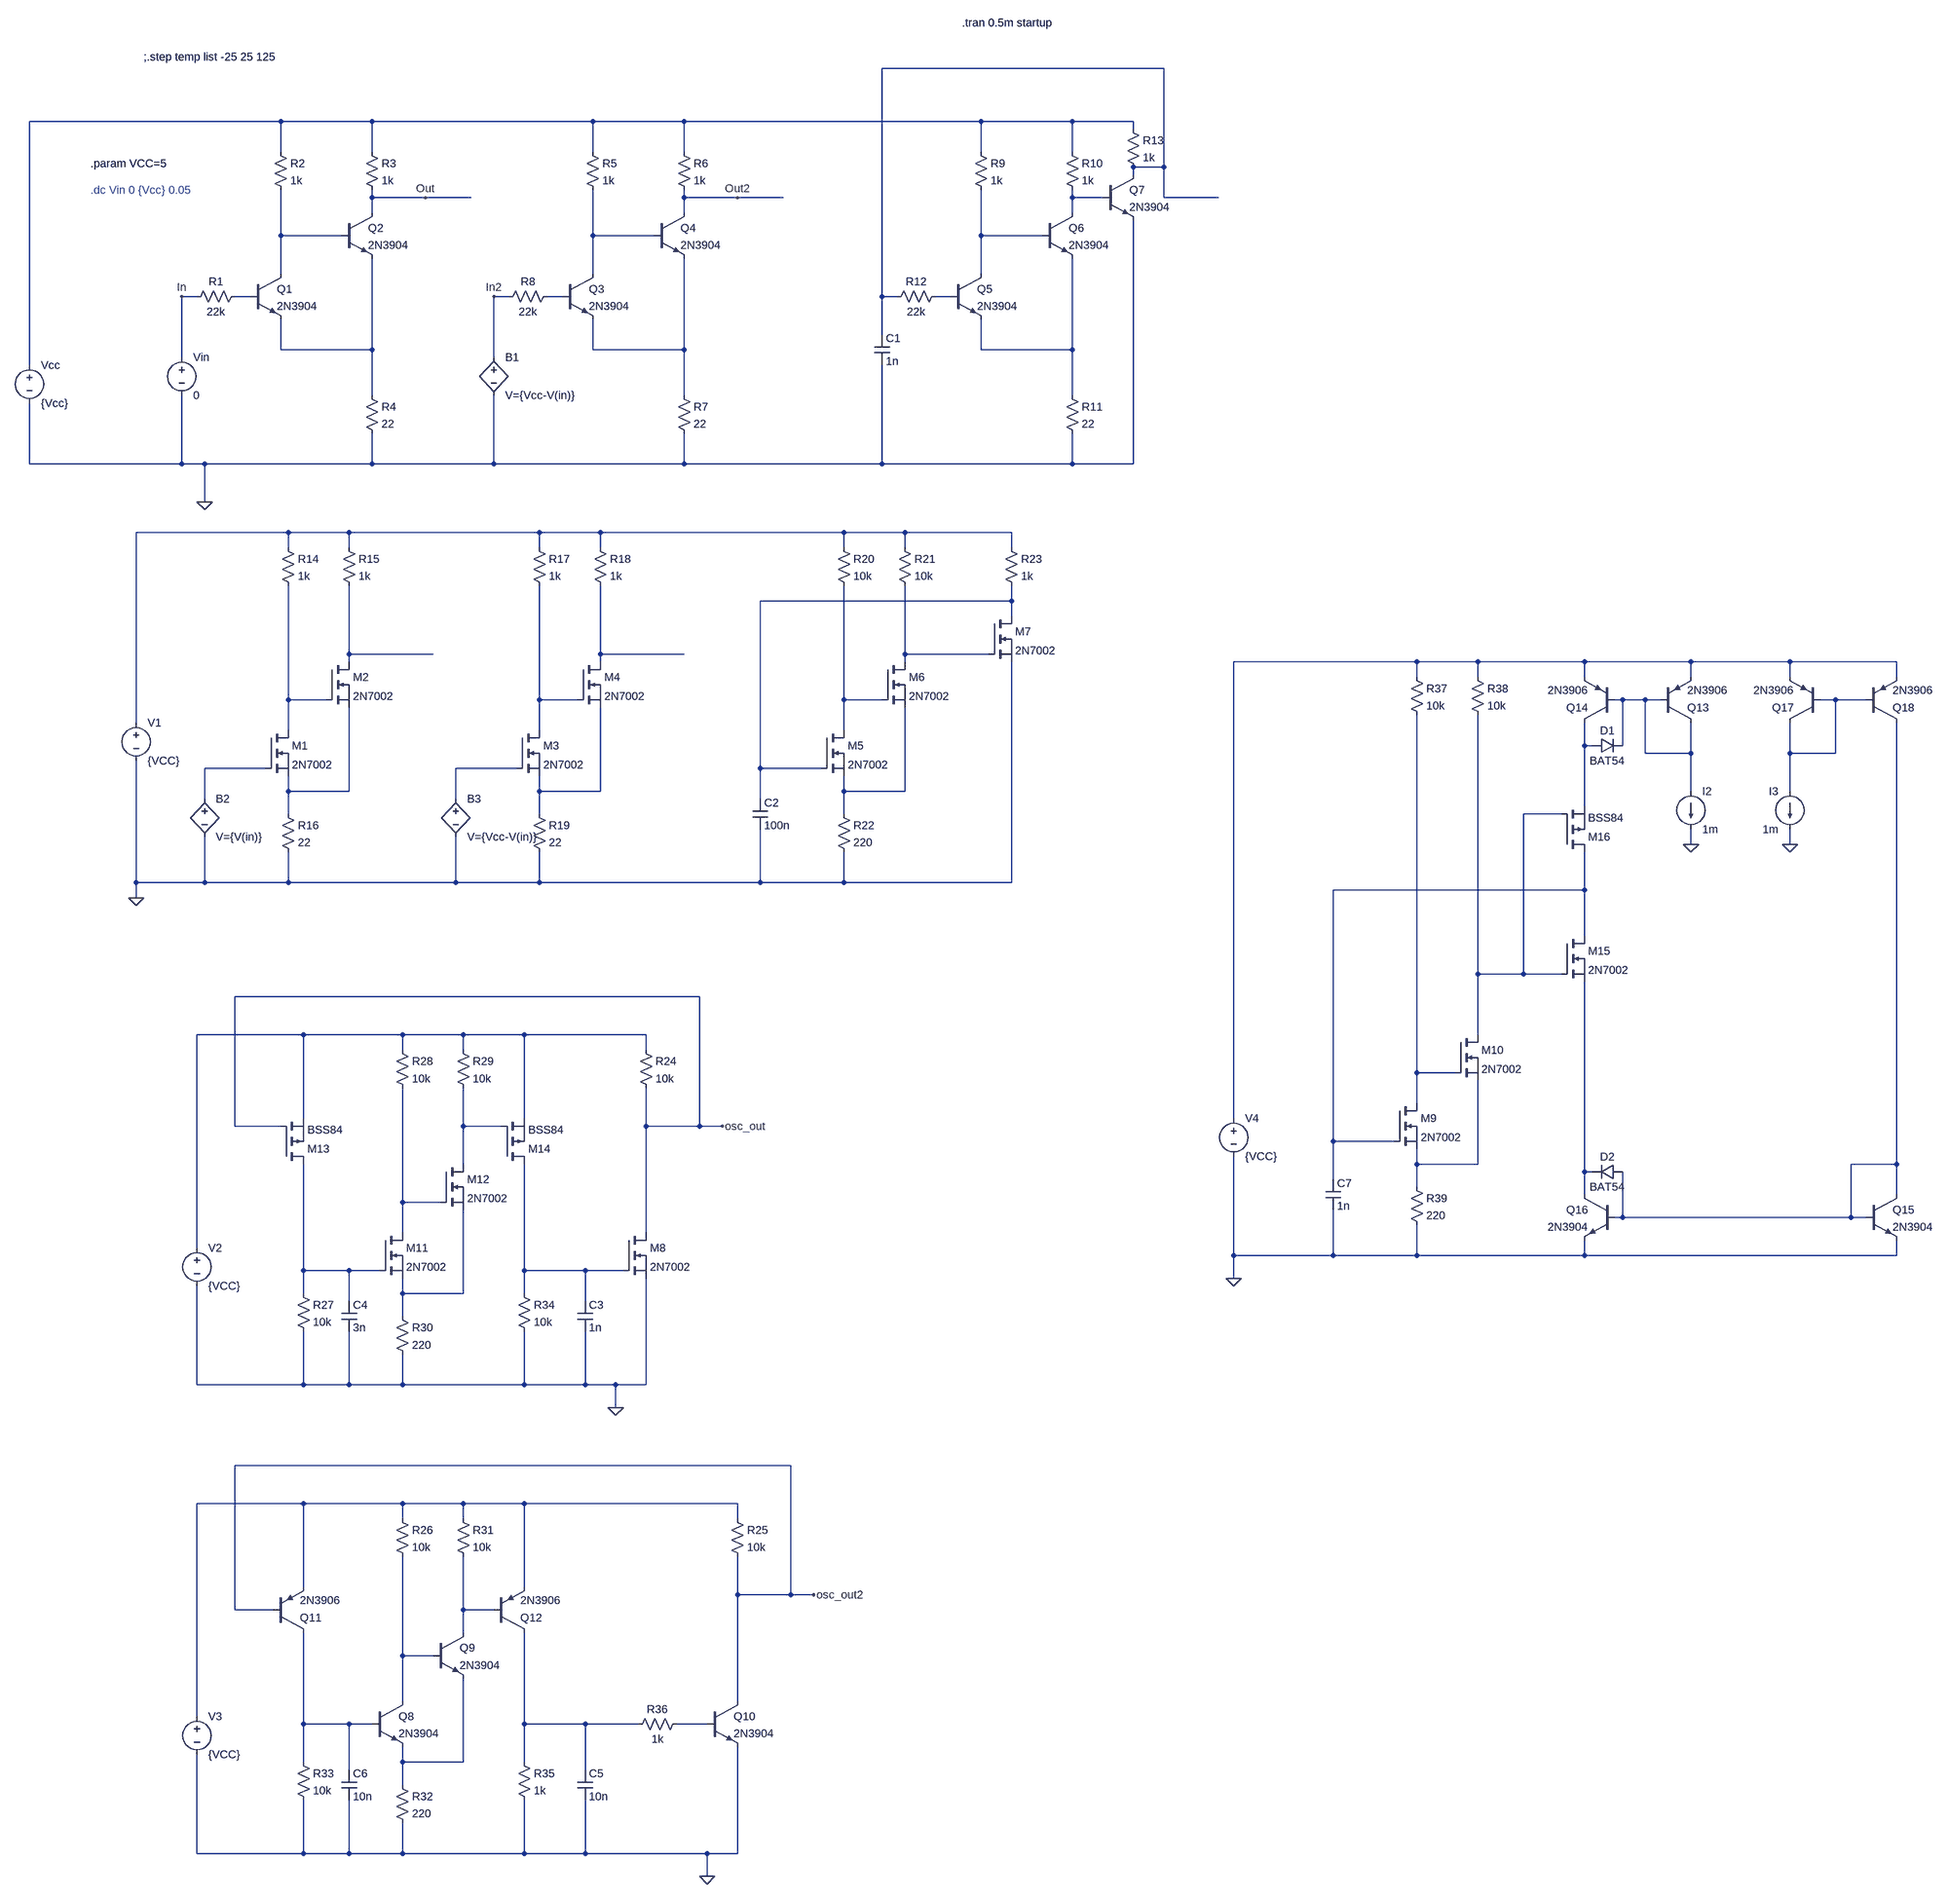
[diagram p0: schematic schmidt_trigger.asc]
schmidt_trigger.asc, the LTspice schematic file:
Version 4.1
SHEET 1 3940 3804
WIRE 2064 -352 1472 -352
WIRE 208 -240 -320 -240
WIRE 400 -240 208 -240
WIRE 864 -240 400 -240
WIRE 1056 -240 864 -240
WIRE 1680 -240 1056 -240
WIRE 1872 -240 1680 -240
WIRE 2000 -240 1872 -240
WIRE 2000 -224 2000 -240
WIRE 208 -176 208 -240
WIRE 400 -176 400 -240
WIRE 864 -176 864 -240
WIRE 1056 -176 1056 -240
WIRE 1680 -176 1680 -240
WIRE 1872 -176 1872 -240
WIRE 2064 -144 2064 -352
WIRE 2064 -144 2000 -144
WIRE 2000 -128 2000 -144
WIRE 400 -80 400 -96
WIRE 512 -80 400 -80
WIRE 608 -80 512 -80
WIRE 1056 -80 1056 -96
WIRE 1168 -80 1056 -80
WIRE 1264 -80 1168 -80
WIRE 1872 -80 1872 -96
WIRE 1936 -80 1872 -80
WIRE 2064 -80 2064 -144
WIRE 2304 -80 2064 -80
WIRE 400 -48 400 -80
WIRE 1056 -48 1056 -80
WIRE 1872 -48 1872 -80
WIRE 208 0 208 -96
WIRE 336 0 208 0
WIRE 864 0 864 -96
WIRE 992 0 864 0
WIRE 1680 0 1680 -96
WIRE 1808 0 1680 0
WIRE 208 80 208 0
WIRE 864 80 864 0
WIRE 1680 80 1680 0
WIRE 32 128 0 128
WIRE 144 128 112 128
WIRE 688 128 656 128
WIRE 800 128 768 128
WIRE 1472 128 1472 -352
WIRE 1504 128 1472 128
WIRE 1616 128 1584 128
WIRE 1472 208 1472 128
WIRE 208 240 208 176
WIRE 400 240 400 48
WIRE 400 240 208 240
WIRE 864 240 864 176
WIRE 1056 240 1056 48
WIRE 1056 240 864 240
WIRE 1680 240 1680 176
WIRE 1872 240 1872 48
WIRE 1872 240 1680 240
WIRE 0 256 0 128
WIRE 656 256 656 128
WIRE -320 272 -320 -240
WIRE 400 336 400 240
WIRE 1056 336 1056 240
WIRE 1872 336 1872 240
WIRE -320 480 -320 352
WIRE 0 480 0 336
WIRE 0 480 -320 480
WIRE 48 480 0 480
WIRE 400 480 400 416
WIRE 400 480 48 480
WIRE 656 480 656 336
WIRE 656 480 400 480
WIRE 1056 480 1056 416
WIRE 1056 480 656 480
WIRE 1472 480 1472 272
WIRE 1472 480 1056 480
WIRE 1872 480 1872 416
WIRE 1872 480 1472 480
WIRE 2000 480 2000 -32
WIRE 2000 480 1872 480
WIRE 48 560 48 480
WIRE 224 624 -96 624
WIRE 352 624 224 624
WIRE 752 624 352 624
WIRE 880 624 752 624
WIRE 1392 624 880 624
WIRE 1520 624 1392 624
WIRE 1744 624 1520 624
WIRE 224 656 224 624
WIRE 352 656 352 624
WIRE 752 656 752 624
WIRE 880 656 880 624
WIRE 1392 656 1392 624
WIRE 1520 656 1520 624
WIRE 1744 656 1744 624
WIRE 1744 768 1744 736
WIRE 1744 768 1216 768
WIRE 1744 800 1744 768
WIRE 352 880 352 736
WIRE 528 880 352 880
WIRE 880 880 880 736
WIRE 1056 880 880 880
WIRE 1520 880 1520 736
WIRE 1696 880 1520 880
WIRE 352 896 352 880
WIRE 880 896 880 880
WIRE 1520 896 1520 880
WIRE 2736 896 2336 896
WIRE 2864 896 2736 896
WIRE 3088 896 2864 896
WIRE 3312 896 3088 896
WIRE 3520 896 3312 896
WIRE 3744 896 3520 896
WIRE 2736 928 2736 896
WIRE 2864 928 2864 896
WIRE 3088 928 3088 896
WIRE 3312 928 3312 896
WIRE 3520 928 3520 896
WIRE 3744 928 3744 896
WIRE 224 976 224 736
WIRE 304 976 224 976
WIRE 752 976 752 736
WIRE 832 976 752 976
WIRE 1392 976 1392 736
WIRE 1472 976 1392 976
WIRE 3168 976 3152 976
WIRE 3216 976 3168 976
WIRE 3248 976 3216 976
WIRE 3616 976 3584 976
WIRE 3680 976 3616 976
WIRE -96 1024 -96 624
WIRE 224 1040 224 976
WIRE 752 1040 752 976
WIRE 1392 1040 1392 976
WIRE 3088 1072 3088 1024
WIRE 3104 1072 3088 1072
WIRE 3168 1072 3168 976
WIRE 3216 1088 3216 976
WIRE 3312 1088 3312 1024
WIRE 3312 1088 3216 1088
WIRE 3520 1088 3520 1024
WIRE 3616 1088 3616 976
WIRE 3616 1088 3520 1088
WIRE 176 1120 48 1120
WIRE 704 1120 576 1120
WIRE 1216 1120 1216 768
WIRE 1344 1120 1216 1120
WIRE 224 1168 224 1136
WIRE 352 1168 352 992
WIRE 352 1168 224 1168
WIRE 752 1168 752 1136
WIRE 880 1168 880 992
WIRE 880 1168 752 1168
WIRE 1392 1168 1392 1136
WIRE 1520 1168 1520 992
WIRE 1520 1168 1392 1168
WIRE 3312 1168 3312 1088
WIRE 3520 1168 3520 1088
WIRE 48 1184 48 1120
WIRE 576 1184 576 1120
WIRE 1216 1184 1216 1120
WIRE 3088 1200 3088 1072
WIRE 224 1216 224 1168
WIRE 752 1216 752 1168
WIRE 1392 1216 1392 1168
WIRE 3040 1216 2960 1216
WIRE 3312 1280 3312 1248
WIRE 3520 1280 3520 1248
WIRE -96 1360 -96 1104
WIRE 48 1360 48 1264
WIRE 48 1360 -96 1360
WIRE 224 1360 224 1296
WIRE 224 1360 48 1360
WIRE 576 1360 576 1264
WIRE 576 1360 224 1360
WIRE 752 1360 752 1296
WIRE 752 1360 576 1360
WIRE 1216 1360 1216 1248
WIRE 1216 1360 752 1360
WIRE 1392 1360 1392 1296
WIRE 1392 1360 1216 1360
WIRE 1744 1360 1744 896
WIRE 1744 1360 1392 1360
WIRE 3088 1376 3088 1296
WIRE 3088 1376 2560 1376
WIRE -96 1392 -96 1360
WIRE 3088 1472 3088 1376
WIRE 2864 1552 2864 1008
WIRE 2960 1552 2960 1216
WIRE 2960 1552 2864 1552
WIRE 3040 1552 2960 1552
WIRE 1088 1600 112 1600
WIRE 256 1680 32 1680
WIRE 464 1680 256 1680
WIRE 592 1680 464 1680
WIRE 720 1680 592 1680
WIRE 976 1680 720 1680
WIRE 2864 1680 2864 1552
WIRE 464 1712 464 1680
WIRE 592 1712 592 1680
WIRE 976 1712 976 1680
WIRE 2736 1760 2736 1008
WIRE 2816 1760 2736 1760
WIRE 2736 1824 2736 1760
WIRE 256 1856 256 1680
WIRE 720 1856 720 1680
WIRE 2336 1856 2336 896
WIRE 112 1872 112 1600
WIRE 208 1872 112 1872
WIRE 592 1872 592 1792
WIRE 672 1872 592 1872
WIRE 976 1872 976 1792
WIRE 1088 1872 1088 1600
WIRE 1088 1872 976 1872
WIRE 1136 1872 1088 1872
WIRE 2560 1904 2560 1376
WIRE 2688 1904 2560 1904
WIRE 592 1952 592 1872
WIRE 2736 1952 2736 1920
WIRE 2864 1952 2864 1776
WIRE 2864 1952 2736 1952
WIRE 3744 1952 3744 1024
WIRE 3744 1952 3648 1952
WIRE 3088 1968 3088 1568
WIRE 3104 1968 3088 1968
WIRE 2560 1984 2560 1904
WIRE 2736 2000 2736 1952
WIRE 3088 2016 3088 1968
WIRE 3744 2016 3744 1952
WIRE 464 2032 464 1792
WIRE 544 2032 464 2032
WIRE 3168 2064 3168 1968
WIRE 3168 2064 3152 2064
WIRE 3648 2064 3648 1952
WIRE 3648 2064 3168 2064
WIRE 3680 2064 3648 2064
WIRE 464 2096 464 2032
WIRE 976 2096 976 1872
WIRE 32 2128 32 1680
WIRE 2336 2144 2336 1936
WIRE 2560 2144 2560 2048
WIRE 2560 2144 2336 2144
WIRE 2736 2144 2736 2080
WIRE 2736 2144 2560 2144
WIRE 3088 2144 3088 2112
WIRE 3088 2144 2736 2144
WIRE 3744 2144 3744 2112
WIRE 3744 2144 3088 2144
WIRE 256 2176 256 1952
WIRE 352 2176 256 2176
WIRE 416 2176 352 2176
WIRE 720 2176 720 1952
WIRE 848 2176 720 2176
WIRE 928 2176 848 2176
WIRE 2336 2192 2336 2144
WIRE 256 2224 256 2176
WIRE 464 2224 464 2192
WIRE 592 2224 592 2048
WIRE 592 2224 464 2224
WIRE 720 2224 720 2176
WIRE 352 2240 352 2176
WIRE 848 2240 848 2176
WIRE 464 2272 464 2224
WIRE 32 2416 32 2208
WIRE 256 2416 256 2304
WIRE 256 2416 32 2416
WIRE 352 2416 352 2304
WIRE 352 2416 256 2416
WIRE 464 2416 464 2352
WIRE 464 2416 352 2416
WIRE 720 2416 720 2304
WIRE 720 2416 464 2416
WIRE 848 2416 848 2304
WIRE 848 2416 720 2416
WIRE 912 2416 848 2416
WIRE 976 2416 976 2192
WIRE 976 2416 912 2416
WIRE 912 2464 912 2416
WIRE 1280 2592 112 2592
WIRE 256 2672 32 2672
WIRE 464 2672 256 2672
WIRE 592 2672 464 2672
WIRE 720 2672 592 2672
WIRE 1168 2672 720 2672
WIRE 464 2704 464 2672
WIRE 592 2704 592 2672
WIRE 1168 2704 1168 2672
WIRE 256 2848 256 2672
WIRE 720 2848 720 2672
WIRE 1168 2864 1168 2784
WIRE 1280 2864 1280 2592
WIRE 1280 2864 1168 2864
WIRE 1328 2864 1280 2864
WIRE 112 2896 112 2592
WIRE 192 2896 112 2896
WIRE 592 2896 592 2784
WIRE 656 2896 592 2896
WIRE 592 2944 592 2896
WIRE 464 2992 464 2784
WIRE 528 2992 464 2992
WIRE 464 3088 464 2992
WIRE 1168 3088 1168 2864
WIRE 32 3120 32 2672
WIRE 256 3136 256 2944
WIRE 352 3136 256 3136
WIRE 400 3136 352 3136
WIRE 720 3136 720 2944
WIRE 848 3136 720 3136
WIRE 960 3136 848 3136
WIRE 1104 3136 1040 3136
WIRE 256 3216 256 3136
WIRE 464 3216 464 3184
WIRE 592 3216 592 3040
WIRE 592 3216 464 3216
WIRE 720 3216 720 3136
WIRE 352 3232 352 3136
WIRE 848 3232 848 3136
WIRE 464 3264 464 3216
WIRE 32 3408 32 3200
WIRE 256 3408 256 3296
WIRE 256 3408 32 3408
WIRE 352 3408 352 3296
WIRE 352 3408 256 3408
WIRE 464 3408 464 3344
WIRE 464 3408 352 3408
WIRE 720 3408 720 3296
WIRE 720 3408 464 3408
WIRE 848 3408 848 3296
WIRE 848 3408 720 3408
WIRE 1104 3408 848 3408
WIRE 1168 3408 1168 3184
WIRE 1168 3408 1104 3408
WIRE 1104 3456 1104 3408
FLAG 48 560 0
FLAG 512 -80 Out
FLAG 0 128 In
FLAG 1168 -80 Out2
FLAG 656 128 In2
FLAG -96 1392 0
FLAG 912 2464 0
FLAG 1136 1872 osc_out
FLAG 1104 3456 0
FLAG 1328 2864 osc_out2
FLAG 2336 2192 0
FLAG 3312 1280 0
FLAG 3520 1280 0
SYMBOL npn 144 80 R0
SYMATTR InstName Q1
SYMATTR Value 2N3904
SYMBOL npn 336 -48 R0
SYMATTR InstName Q2
SYMATTR Value 2N3904
SYMBOL voltage 0 240 R0
SYMATTR InstName Vin
SYMATTR Value 0
SYMBOL voltage -320 256 R0
SYMATTR InstName Vcc
SYMATTR Value {Vcc}
SYMBOL res 192 -192 R0
SYMATTR InstName R2
SYMATTR Value 1k
SYMBOL res 384 -192 R0
SYMATTR InstName R3
SYMATTR Value 1k
SYMBOL res 384 320 R0
SYMATTR InstName R4
SYMATTR Value 22
SYMBOL res 128 112 R90
WINDOW 0 0 56 VBottom 2
WINDOW 3 32 56 VTop 2
SYMATTR InstName R1
SYMATTR Value 22k
SYMBOL npn 800 80 R0
SYMATTR InstName Q3
SYMATTR Value 2N3904
SYMBOL npn 992 -48 R0
SYMATTR InstName Q4
SYMATTR Value 2N3904
SYMBOL res 848 -192 R0
SYMATTR InstName R5
SYMATTR Value 1k
SYMBOL res 1040 -192 R0
SYMATTR InstName R6
SYMATTR Value 1k
SYMBOL res 1040 320 R0
SYMATTR InstName R7
SYMATTR Value 22
SYMBOL res 784 112 R90
WINDOW 0 0 56 VBottom 2
WINDOW 3 32 56 VTop 2
SYMATTR InstName R8
SYMATTR Value 22k
SYMBOL bv 656 240 R0
SYMATTR InstName B1
SYMATTR Value V={Vcc-V(in)}
SYMBOL npn 1616 80 R0
SYMATTR InstName Q5
SYMATTR Value 2N3904
SYMBOL npn 1808 -48 R0
SYMATTR InstName Q6
SYMATTR Value 2N3904
SYMBOL res 1664 -192 R0
SYMATTR InstName R9
SYMATTR Value 1k
SYMBOL res 1856 -192 R0
SYMATTR InstName R10
SYMATTR Value 1k
SYMBOL res 1856 320 R0
SYMATTR InstName R11
SYMATTR Value 22
SYMBOL res 1600 112 R90
WINDOW 0 0 56 VBottom 2
WINDOW 3 32 56 VTop 2
SYMATTR InstName R12
SYMATTR Value 22k
SYMBOL cap 1456 208 R0
SYMATTR InstName C1
SYMATTR Value 1n
SYMBOL npn 1936 -128 R0
SYMATTR InstName Q7
SYMATTR Value 2N3904
SYMBOL res 1984 -240 R0
SYMATTR InstName R13
SYMATTR Value 1k
SYMBOL nmos 176 1040 R0
SYMATTR InstName M1
SYMATTR Value 2N7002
SYMBOL nmos 304 896 R0
SYMATTR InstName M2
SYMATTR Value 2N7002
SYMBOL res 208 640 R0
SYMATTR InstName R14
SYMATTR Value 1k
SYMBOL res 336 640 R0
SYMATTR InstName R15
SYMATTR Value 1k
SYMBOL res 208 1200 R0
SYMATTR InstName R16
SYMATTR Value 22
SYMBOL voltage -96 1008 R0
SYMATTR InstName V1
SYMATTR Value {VCC}
SYMBOL bv 48 1168 R0
SYMATTR InstName B2
SYMATTR Value V={V(in)}
SYMBOL nmos 704 1040 R0
SYMATTR InstName M3
SYMATTR Value 2N7002
SYMBOL nmos 832 896 R0
SYMATTR InstName M4
SYMATTR Value 2N7002
SYMBOL res 736 640 R0
SYMATTR InstName R17
SYMATTR Value 1k
SYMBOL res 864 640 R0
SYMATTR InstName R18
SYMATTR Value 1k
SYMBOL res 736 1200 R0
SYMATTR InstName R19
SYMATTR Value 22
SYMBOL bv 576 1168 R0
SYMATTR InstName B3
SYMATTR Value V={Vcc-V(in)}
SYMBOL nmos 1344 1040 R0
SYMATTR InstName M5
SYMATTR Value 2N7002
SYMBOL nmos 1472 896 R0
SYMATTR InstName M6
SYMATTR Value 2N7002
SYMBOL res 1376 640 R0
SYMATTR InstName R20
SYMATTR Value 10k
SYMBOL res 1504 640 R0
SYMATTR InstName R21
SYMATTR Value 10k
SYMBOL res 1376 1200 R0
SYMATTR InstName R22
SYMATTR Value 220
SYMBOL nmos 1696 800 R0
SYMATTR InstName M7
SYMATTR Value 2N7002
SYMBOL res 1728 640 R0
SYMATTR InstName R23
SYMATTR Value 1k
SYMBOL cap 1200 1184 R0
SYMATTR InstName C2
SYMATTR Value 100n
SYMBOL nmos 928 2096 R0
SYMATTR InstName M8
SYMATTR Value 2N7002
SYMBOL res 960 1696 R0
SYMATTR InstName R24
SYMATTR Value 10k
SYMBOL cap 832 2240 R0
SYMATTR InstName C3
SYMATTR Value 1n
SYMBOL nmos 416 2096 R0
SYMATTR InstName M11
SYMATTR Value 2N7002
SYMBOL nmos 544 1952 R0
SYMATTR InstName M12
SYMATTR Value 2N7002
SYMBOL res 448 1696 R0
SYMATTR InstName R28
SYMATTR Value 10k
SYMBOL res 576 1696 R0
SYMATTR InstName R29
SYMATTR Value 10k
SYMBOL res 448 2256 R0
SYMATTR InstName R30
SYMATTR Value 220
SYMBOL cap 336 2240 R0
SYMATTR InstName C4
SYMATTR Value 3n
SYMBOL voltage 32 2112 R0
SYMATTR InstName V2
SYMATTR Value {VCC}
SYMBOL res 240 2208 R0
SYMATTR InstName R27
SYMATTR Value 10k
SYMBOL pmos 208 1952 M180
SYMATTR InstName M13
SYMATTR Value BSS84
SYMBOL res 704 2208 R0
SYMATTR InstName R34
SYMATTR Value 10k
SYMBOL pmos 672 1952 M180
SYMATTR InstName M14
SYMATTR Value BSS84
SYMBOL res 1152 2688 R0
SYMATTR InstName R25
SYMATTR Value 10k
SYMBOL cap 832 3232 R0
SYMATTR InstName C5
SYMATTR Value 10n
SYMBOL res 448 2688 R0
SYMATTR InstName R26
SYMATTR Value 10k
SYMBOL res 576 2688 R0
SYMATTR InstName R31
SYMATTR Value 10k
SYMBOL res 448 3248 R0
SYMATTR InstName R32
SYMATTR Value 220
SYMBOL cap 336 3232 R0
SYMATTR InstName C6
SYMATTR Value 10n
SYMBOL voltage 32 3104 R0
SYMATTR InstName V3
SYMATTR Value {VCC}
SYMBOL res 240 3200 R0
SYMATTR InstName R33
SYMATTR Value 10k
SYMBOL res 704 3200 R0
SYMATTR InstName R35
SYMATTR Value 1k
SYMBOL npn 400 3088 R0
SYMATTR InstName Q8
SYMATTR Value 2N3904
SYMBOL npn 528 2944 R0
SYMATTR InstName Q9
SYMATTR Value 2N3904
SYMBOL npn 1104 3088 R0
SYMATTR InstName Q10
SYMATTR Value 2N3904
SYMBOL pnp 192 2944 M180
SYMATTR InstName Q11
SYMATTR Value 2N3906
SYMBOL pnp 656 2944 M180
SYMATTR InstName Q12
SYMATTR Value 2N3906
SYMBOL res 1056 3120 R90
WINDOW 0 0 56 VBottom 2
WINDOW 3 32 56 VTop 2
SYMATTR InstName R36
SYMATTR Value 1k
SYMBOL nmos 2688 1824 R0
SYMATTR InstName M9
SYMATTR Value 2N7002
SYMBOL nmos 2816 1680 R0
SYMATTR InstName M10
SYMATTR Value 2N7002
SYMBOL res 2720 912 R0
SYMATTR InstName R37
SYMATTR Value 10k
SYMBOL res 2848 912 R0
SYMATTR InstName R38
SYMATTR Value 10k
SYMBOL res 2720 1984 R0
SYMATTR InstName R39
SYMATTR Value 220
SYMBOL nmos 3040 1472 R0
SYMATTR InstName M15
SYMATTR Value 2N7002
SYMBOL cap 2544 1984 R0
SYMATTR InstName C7
SYMATTR Value 1n
SYMBOL voltage 2336 1840 R0
SYMATTR InstName V4
SYMATTR Value {VCC}
SYMBOL pmos 3040 1296 M180
SYMATTR InstName M16
SYMATTR Value BSS84
SYMBOL current 3312 1168 R0
SYMATTR InstName I2
SYMATTR Value 1m
SYMBOL pnp 3248 1024 M180
SYMATTR InstName Q13
SYMATTR Value 2N3906
SYMBOL pnp 3152 1024 R180
SYMATTR InstName Q14
SYMATTR Value 2N3906
SYMBOL diode 3104 1088 R270
WINDOW 0 32 32 VTop 2
WINDOW 3 0 32 VBottom 2
SYMATTR InstName D1
SYMATTR Value BAT54
SYMATTR Description Diode
SYMATTR Type diode
SYMBOL diode 3168 1984 M270
WINDOW 0 32 32 VTop 2
WINDOW 3 0 32 VBottom 2
SYMATTR InstName D2
SYMATTR Value BAT54
SYMATTR Description Diode
SYMATTR Type diode
SYMBOL npn 3680 2016 R0
SYMATTR InstName Q15
SYMATTR Value 2N3904
SYMBOL npn 3152 2016 M0
SYMATTR InstName Q16
SYMATTR Value 2N3904
SYMBOL current 3520 1168 M0
SYMATTR InstName I3
SYMATTR Value 1m
SYMBOL pnp 3584 1024 R180
SYMATTR InstName Q17
SYMATTR Value 2N3906
SYMBOL pnp 3680 1024 M180
SYMATTR InstName Q18
SYMATTR Value 2N3906
TEXT -192 -96 Left 2 ;.dc Vin 0 {Vcc} 0.05
TEXT -192 -152 Left 2 !.param VCC=5
TEXT -80 -376 Left 2 !;.step temp list -25 25 125
TEXT 1640 -448 Left 2 !.tran 0.5m startup

The netlist it stands for:
* schmidt_trigger.asc
Q1 N004 N007 N010 0 2N3904
Q2 Out N004 N010 0 2N3904
Vin In 0 0
Vcc N002 0 {Vcc}
R2 N002 N004 1k
R3 N002 Out 1k
R4 N010 0 22
R1 N007 In 22k
Q3 N005 N008 N011 0 2N3904
Q4 Out2 N005 N011 0 2N3904
R5 N002 N005 1k
R6 N002 Out2 1k
R7 N011 0 22
R8 N008 In2 22k
B1 In2 0 V={Vcc-V(in)}
Q5 N006 N009 N012 0 2N3904
Q6 N003 N006 N012 0 2N3904
R9 N002 N006 1k
R10 N002 N003 1k
R11 N012 0 22
R12 N009 N001 22k
C1 N001 0 1n
Q7 N001 N003 0 0 2N3904
R13 N002 N001 1k
M1 N019 N025 N027 N027 2N7002
M2 N015 N019 N027 N027 2N7002
R14 N013 N019 1k
R15 N013 N015 1k
R16 N027 0 22
V1 N013 0 {VCC}
B2 N025 0 V={V(in)}
M3 N020 N026 N028 N028 2N7002
M4 N016 N020 N028 N028 2N7002
R17 N013 N020 1k
R18 N013 N016 1k
R19 N028 0 22
B3 N026 0 V={Vcc-V(in)}
M5 N021 N014 N029 N029 2N7002
M6 N017 N021 N029 N029 2N7002
R20 N013 N021 10k
R21 N013 N017 10k
R22 N029 0 220
M7 N014 N017 0 0 2N7002
R23 N013 N014 1k
C2 N014 0 100n
M8 osc_out N040 0 0 2N7002
R24 N032 osc_out 10k
C3 N040 0 1n
M11 N038 N039 N041 N041 2N7002
M12 N034 N038 N041 N041 2N7002
R28 N032 N038 10k
R29 N032 N034 10k
R30 N041 0 220
C4 N039 0 3n
V2 N032 0 {VCC}
R27 N039 0 10k
M13 N039 osc_out N032 N032 BSS84
R34 N040 0 10k
M14 N040 N034 N032 N032 BSS84
R25 N042 osc_out2 10k
C5 N046 0 10n
R26 N042 N044 10k
R31 N042 N043 10k
R32 N048 0 220
C6 N045 0 10n
V3 N042 0 {VCC}
R33 N045 0 10k
R35 N046 0 1k
Q8 N044 N045 N048 0 2N3904
Q9 N043 N044 N048 0 2N3904
Q10 osc_out2 N047 0 0 2N3904
Q11 N045 osc_out2 N042 0 2N3906
Q12 N046 N043 N042 0 2N3906
R36 N047 N046 1k
M9 N033 N031 N035 N035 2N7002
M10 N030 N033 N035 N035 2N7002
R37 N018 N033 10k
R38 N018 N030 10k
R39 N035 0 220
M15 N031 N030 N037 N037 2N7002
C7 N031 0 1n
V4 N018 0 {VCC}
M16 N031 N030 N024 N024 BSS84
I2 N022 0 1m
Q13 N022 N022 N018 0 2N3906
Q14 N024 N022 N018 0 2N3906
D1 N024 N022 BAT54
D2 N036 N037 BAT54
Q15 N036 N036 0 0 2N3904
Q16 N037 N036 0 0 2N3904
I3 N023 0 1m
Q17 N023 N023 N018 0 2N3906
Q18 N036 N023 N018 0 2N3906
.model D D
.lib standard.dio
.model NPN NPN
.model PNP PNP
.lib standard.bjt
.model NMOS NMOS
.model PMOS PMOS
.lib standard.mos
* .dc Vin 0 {Vcc} 0.05
.param VCC=5
;.step temp list -25 25 125
.tran 0.5m startup
.backanno
.end